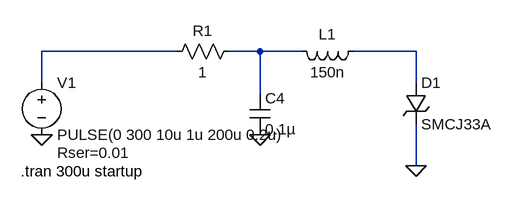
[diagram p0: schematic DO160Test.asc]
DO160Test.asc, the LTspice schematic file:
Version 4
SHEET 1 880 708
WIRE 32 144 -176 144
WIRE 160 144 112 144
WIRE 224 144 160 144
WIRE 400 144 304 144
WIRE -176 192 -176 144
WIRE 400 192 400 144
WIRE 160 208 160 144
WIRE 400 320 400 256
FLAG -176 272 0
FLAG 400 320 0
FLAG 160 272 0
SYMBOL res 128 128 R90
WINDOW 0 0 56 VBottom 2
WINDOW 3 32 56 VTop 2
SYMATTR InstName R1
SYMATTR Value 1
SYMATTR SpiceLine tol=1 pwr=0.1
SYMBOL voltage -176 176 R0
WINDOW 123 0 0 Left 2
WINDOW 39 24 124 Left 2
SYMATTR SpiceLine Rser=0.01
SYMATTR InstName V1
SYMATTR Value PULSE(0 300 10u 1u 200u 0.2u)
SYMBOL TVSdiode 384 192 R0
SYMATTR InstName D1
SYMATTR Value SMCJ33A
SYMBOL ind 320 128 R90
WINDOW 0 5 56 VBottom 2
WINDOW 3 32 56 VTop 2
SYMATTR InstName L1
SYMATTR Value 150n
SYMATTR SpiceLine Ipk=25 Rser=0.00058 Rpar=299.86 Cpar=2.55p mfg="Wurth Elektronik" pn="744355215 WE-HCI 1040"
SYMBOL cap 144 208 R0
SYMATTR InstName C4
SYMATTR Value 0.1µ
SYMATTR SpiceLine V=500 Irms=867m Rser=0.0254657 Lser=0 mfg="KEMET" pn="C1812C104KCRAC" type="X7R"
TEXT -208 328 Left 2 !.tran 300u startup

The netlist it stands for:
* DO160Test.asc
R1 N002 N001 1 tol=1 pwr=0.1
V1 N001 0 PULSE(0 300 10u 1u 200u 0.2u) Rser=0.01
D1 N003 0 SMCJ33A
L1 N003 N002 150n Ipk=25 Rser=0.00058 Rpar=299.86 Cpar=2.55p mfg="Wurth Elektronik" pn="744355215 WE-HCI 1040"
C4 N002 0 0.1µ V=500 Irms=867m Rser=0.0254657 Lser=0 mfg="KEMET" pn="C1812C104KCRAC" type="X7R"
.model D D
.lib standard.dio
.tran 300u startup
.backanno
.end